# Altium project Current_sens.PrjPcb
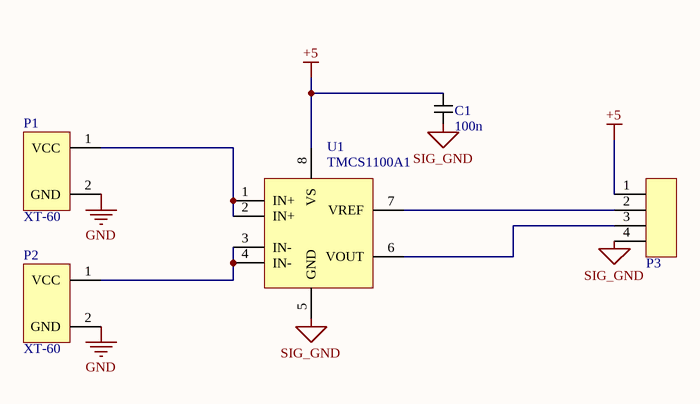
[diagram p0: Current_sens.SchDoc]
1 sheet, 5 parts. Net scope: global (net labels, ports and power ports of the same name join across sheets).
Board file: Current_sens.PcbDoc

## Sheet Current_sens.SchDoc
size A4

### Parts
C1  value 100n  [C_SMD_0805_pcb]  (hidden comment: SMD)
P1  XT-60  [XT-60]
P2  XT-60  [XT-60]
P3  JST_SE_4PIN  [JST_SE_4PIN]  (value not drawn)
U1  Part_name: TMCS1100A1  [SOIC-8]  (hidden comment: TMSC1100A1)

### Nets
+5: C1.1 P3.1 U1.8(VS)
GND: P1.2(GND) P2.2(GND)
SIG_GND: C1.2 P3.4 U1.5(GND)
NetP1_1: P1.1(VCC) U1.1(IN+) U1.2(IN+)
NetP2_1: P2.1(VCC) U1.3(IN-) U1.4(IN-)
NetP3_2: P3.2 U1.7(VREF)
NetP3_3: P3.3 U1.6(VOUT)

### Library data of the parts
C1 = C_SMD_0805: Supplier 1: *; Supplier Part Number 1: *
P1 P2 = XT-60: Supplier Part Number 1: 1568-1816-ND; Supplier Link 1: https://www.digikey.com/product-detail/en/sparkfun-electronics/PRT-10474/1568-1816-ND/8258064
P3 = JST_SE_4PIN: Supplier Link 1: https://www.digikey.com/product-detail/en/jst-sales-america-inc/S4B-XH-A-LF-SN/455-2243-ND/1651041; Supplier Part Number 1: 455-2243-ND